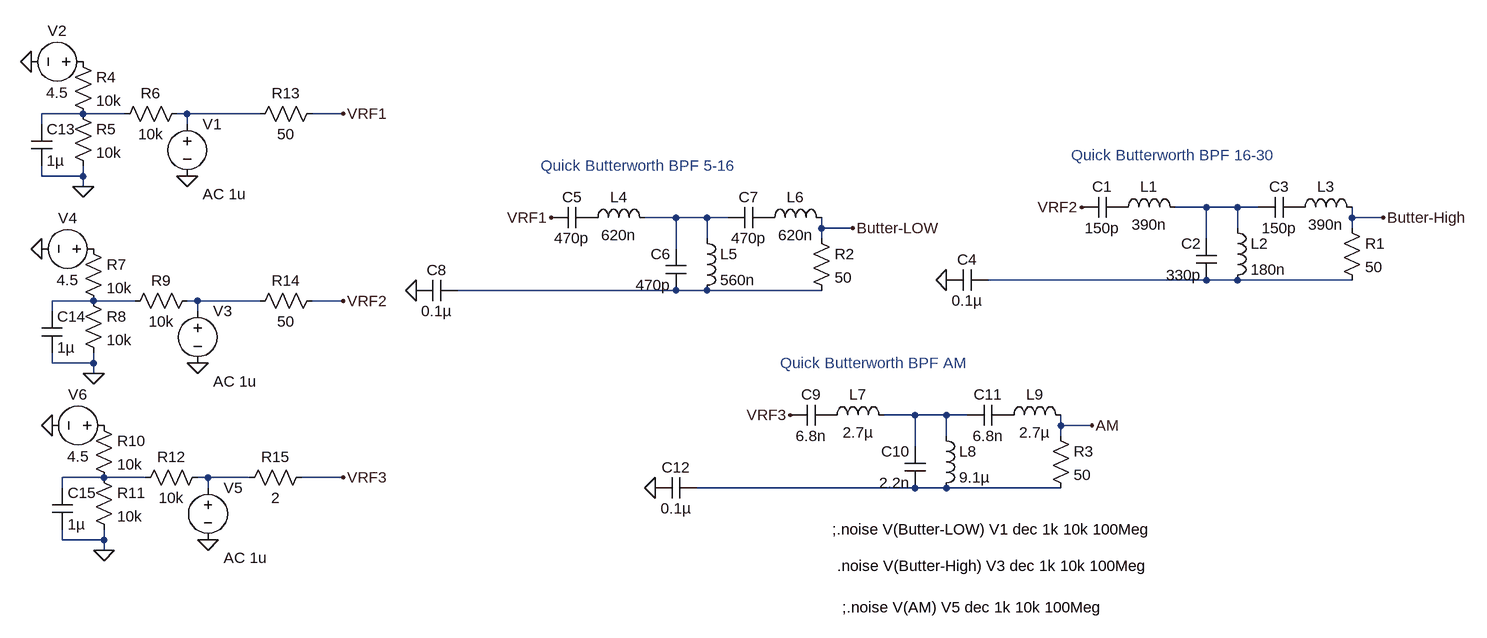
[diagram p0: schematic BPF_noise_analysis.asc]
BPF_noise_analysis.asc, the LTspice schematic file:
Version 4
SHEET 1 1868 808
WIRE -288 32 -352 32
WIRE -224 32 -288 32
WIRE -128 32 -144 32
WIRE -16 32 -128 32
WIRE 112 32 64 32
WIRE -352 48 -352 32
WIRE -128 48 -128 32
WIRE -352 128 -352 112
WIRE -288 128 -288 112
WIRE -288 128 -352 128
WIRE -288 144 -288 128
WIRE 1440 176 1392 176
WIRE 1488 176 1440 176
WIRE 1520 176 1488 176
WIRE 624 192 576 192
WIRE 672 192 624 192
WIRE 704 192 672 192
WIRE 1664 192 1664 176
WIRE 1712 192 1664 192
WIRE 848 208 848 192
WIRE 896 208 848 208
WIRE 1488 208 1488 176
WIRE 1664 208 1664 192
WIRE 672 224 672 192
WIRE 848 224 848 208
WIRE 1440 224 1440 176
WIRE 624 240 624 192
WIRE 1440 288 1104 288
WIRE 1488 288 1440 288
WIRE 1664 288 1488 288
WIRE 624 304 288 304
WIRE 672 304 624 304
WIRE 848 304 672 304
WIRE -272 320 -336 320
WIRE -208 320 -272 320
WIRE -112 320 -128 320
WIRE -16 320 -112 320
WIRE 112 320 64 320
WIRE -336 336 -336 320
WIRE -112 336 -112 320
WIRE -336 416 -336 400
WIRE -272 416 -272 400
WIRE -272 416 -336 416
WIRE -272 432 -272 416
WIRE 992 496 944 496
WIRE 1040 496 992 496
WIRE 1072 496 1040 496
WIRE 1216 512 1216 496
WIRE 1264 512 1216 512
WIRE 1040 528 1040 496
WIRE 1216 528 1216 512
WIRE 992 544 992 496
WIRE -256 592 -320 592
WIRE -192 592 -256 592
WIRE -96 592 -112 592
WIRE -32 592 -96 592
WIRE 112 592 48 592
WIRE -320 608 -320 592
WIRE -96 608 -96 592
WIRE 992 608 656 608
WIRE 1040 608 992 608
WIRE 1216 608 1040 608
WIRE -320 688 -320 672
WIRE -256 688 -256 672
WIRE -256 688 -320 688
WIRE -256 704 -256 688
FLAG 112 32 VRF1
FLAG 1040 288 0
FLAG 1712 192 Butter-High
FLAG 1248 176 VRF2
FLAG 224 304 0
FLAG 896 208 Butter-LOW
FLAG 432 192 VRF1
FLAG 592 608 0
FLAG 1264 512 AM
FLAG 800 496 VRF3
FLAG -128 128 0
FLAG -368 -48 0
FLAG -288 144 0
FLAG 112 320 VRF2
FLAG -112 416 0
FLAG -352 240 0
FLAG -272 432 0
FLAG 112 592 VRF3
FLAG -96 688 0
FLAG -336 512 0
FLAG -256 704 0
SYMBOL res 1648 192 R0
SYMATTR InstName R1
SYMATTR Value 50
SYMBOL cap 1312 160 R90
WINDOW 0 0 32 VBottom 2
WINDOW 3 32 32 VTop 2
SYMATTR InstName C1
SYMATTR Value 150p
SYMBOL cap 1456 288 R180
WINDOW 0 24 56 Left 2
WINDOW 3 24 8 Left 2
SYMATTR InstName C2
SYMATTR Value 330p
SYMBOL cap 1520 192 R270
WINDOW 0 32 32 VTop 2
WINDOW 3 0 32 VBottom 2
SYMATTR InstName C3
SYMATTR Value 150p
SYMBOL ind 1296 192 R270
WINDOW 0 32 56 VTop 2
WINDOW 3 5 56 VBottom 2
SYMATTR InstName L1
SYMATTR Value 390n
SYMBOL ind 1472 192 R0
SYMATTR InstName L2
SYMATTR Value 180n
SYMBOL ind 1568 192 R270
WINDOW 0 32 56 VTop 2
WINDOW 3 5 56 VBottom 2
SYMATTR InstName L3
SYMATTR Value 390n
SYMBOL cap 1104 272 R90
WINDOW 0 0 32 VBottom 2
WINDOW 3 32 32 VTop 2
SYMATTR InstName C4
SYMATTR Value 0.1µ
SYMBOL res 832 208 R0
SYMATTR InstName R2
SYMATTR Value 50
SYMBOL cap 496 176 R90
WINDOW 0 0 32 VBottom 2
WINDOW 3 32 32 VTop 2
SYMATTR InstName C5
SYMATTR Value 470p
SYMBOL cap 640 304 R180
WINDOW 0 24 56 Left 2
WINDOW 3 24 8 Left 2
SYMATTR InstName C6
SYMATTR Value 470p
SYMBOL cap 704 208 R270
WINDOW 0 32 32 VTop 2
WINDOW 3 0 32 VBottom 2
SYMATTR InstName C7
SYMATTR Value 470p
SYMBOL ind 480 208 R270
WINDOW 0 32 56 VTop 2
WINDOW 3 5 56 VBottom 2
SYMATTR InstName L4
SYMATTR Value 620n
SYMBOL ind 656 208 R0
SYMATTR InstName L5
SYMATTR Value 560n
SYMBOL ind 752 208 R270
WINDOW 0 32 56 VTop 2
WINDOW 3 5 56 VBottom 2
SYMATTR InstName L6
SYMATTR Value 620n
SYMBOL cap 288 288 R90
WINDOW 0 0 32 VBottom 2
WINDOW 3 32 32 VTop 2
SYMATTR InstName C8
SYMATTR Value 0.1µ
SYMBOL res 1200 512 R0
SYMATTR InstName R3
SYMATTR Value 50
SYMBOL cap 864 480 R90
WINDOW 0 0 32 VBottom 2
WINDOW 3 32 32 VTop 2
SYMATTR InstName C9
SYMATTR Value 6.8n
SYMBOL cap 1008 608 R180
WINDOW 0 24 56 Left 2
WINDOW 3 24 8 Left 2
SYMATTR InstName C10
SYMATTR Value 2.2n
SYMBOL cap 1072 512 R270
WINDOW 0 32 32 VTop 2
WINDOW 3 0 32 VBottom 2
SYMATTR InstName C11
SYMATTR Value 6.8n
SYMBOL ind 848 512 R270
WINDOW 0 32 56 VTop 2
WINDOW 3 5 56 VBottom 2
SYMATTR InstName L7
SYMATTR Value 2.7µ
SYMBOL ind 1024 512 R0
SYMATTR InstName L8
SYMATTR Value 9.1µ
SYMBOL ind 1120 512 R270
WINDOW 0 32 56 VTop 2
WINDOW 3 5 56 VBottom 2
SYMATTR InstName L9
SYMATTR Value 2.7µ
SYMBOL cap 656 592 R90
WINDOW 0 0 32 VBottom 2
WINDOW 3 32 32 VTop 2
SYMATTR InstName C12
SYMATTR Value 0.1µ
SYMBOL voltage -128 32 R0
WINDOW 123 24 124 Left 2
WINDOW 39 0 0 Left 0
SYMATTR Value2 AC 1u
SYMATTR InstName V1
SYMATTR Value ""
SYMBOL voltage -272 -48 R90
WINDOW 0 -32 56 VBottom 2
WINDOW 3 32 56 VTop 2
WINDOW 123 0 0 Left 0
WINDOW 39 0 0 Left 0
SYMATTR InstName V2
SYMATTR Value 4.5
SYMBOL res -304 -64 R0
SYMATTR InstName R4
SYMATTR Value 10k
SYMBOL res -304 16 R0
SYMATTR InstName R5
SYMATTR Value 10k
SYMBOL cap -368 48 R0
SYMATTR InstName C13
SYMATTR Value 1µ
SYMBOL res -128 16 R90
WINDOW 0 0 56 VBottom 2
WINDOW 3 32 56 VTop 2
SYMATTR InstName R6
SYMATTR Value 10k
SYMBOL voltage -112 320 R0
WINDOW 123 24 124 Left 2
WINDOW 39 0 0 Left 0
SYMATTR Value2 AC 1u
SYMATTR InstName V3
SYMATTR Value ""
SYMBOL voltage -256 240 R90
WINDOW 0 -32 56 VBottom 2
WINDOW 3 32 56 VTop 2
WINDOW 123 0 0 Left 0
WINDOW 39 0 0 Left 0
SYMATTR InstName V4
SYMATTR Value 4.5
SYMBOL res -288 224 R0
SYMATTR InstName R7
SYMATTR Value 10k
SYMBOL res -288 304 R0
SYMATTR InstName R8
SYMATTR Value 10k
SYMBOL cap -352 336 R0
SYMATTR InstName C14
SYMATTR Value 1µ
SYMBOL res -112 304 R90
WINDOW 0 0 56 VBottom 2
WINDOW 3 32 56 VTop 2
SYMATTR InstName R9
SYMATTR Value 10k
SYMBOL voltage -96 592 R0
WINDOW 123 24 124 Left 2
WINDOW 39 0 0 Left 0
SYMATTR Value2 AC 1u
SYMATTR InstName V5
SYMATTR Value ""
SYMBOL voltage -240 512 R90
WINDOW 0 -32 56 VBottom 2
WINDOW 3 32 56 VTop 2
WINDOW 123 0 0 Left 0
WINDOW 39 0 0 Left 0
SYMATTR InstName V6
SYMATTR Value 4.5
SYMBOL res -272 496 R0
SYMATTR InstName R10
SYMATTR Value 10k
SYMBOL res -272 576 R0
SYMATTR InstName R11
SYMATTR Value 10k
SYMBOL cap -336 608 R0
SYMATTR InstName C15
SYMATTR Value 1µ
SYMBOL res -96 576 R90
WINDOW 0 0 56 VBottom 2
WINDOW 3 32 56 VTop 2
SYMATTR InstName R12
SYMATTR Value 10k
SYMBOL res 80 16 R90
WINDOW 0 0 56 VBottom 2
WINDOW 3 32 56 VTop 2
SYMATTR InstName R13
SYMATTR Value 50
SYMBOL res 80 304 R90
WINDOW 0 0 56 VBottom 2
WINDOW 3 32 56 VTop 2
SYMATTR InstName R14
SYMATTR Value 50
SYMBOL res 64 576 R90
WINDOW 0 0 56 VBottom 2
WINDOW 3 32 56 VTop 2
SYMATTR InstName R15
SYMATTR Value 2
TEXT 1232 96 Left 2 ;Quick Butterworth BPF 16-30
TEXT 416 112 Left 2 ;Quick Butterworth BPF 5-16
TEXT 784 416 Left 2 ;Quick Butterworth BPF AM
TEXT 864 672 Left 2 !;.noise V(Butter-LOW) V1 dec 1k 10k 100Meg
TEXT 872 728 Left 2 !.noise V(Butter-High) V3 dec 1k 10k 100Meg
TEXT 880 792 Left 2 !;.noise V(AM) V5 dec 1k 10k 100Meg

The netlist it stands for:
* BPF_noise_analysis.asc
R1 Butter-High N005 50
C1 P001 VRF2 150p
C2 N005 N003 330p
C3 N003 P002 150p
L1 P001 N003 390n
L2 N003 N005 180n
L3 P002 Butter-High 390n
C4 N005 0 0.1µ
R2 Butter-LOW N006 50
C5 P003 VRF1 470p
C6 N006 N004 470p
C7 N004 P004 470p
L4 P003 N004 620n
L5 N004 N006 560n
L6 P004 Butter-LOW 620n
C8 N006 0 0.1µ
R3 AM N012 50
C9 P005 VRF3 6.8n
C10 N012 N009 2.2n
C11 N009 P006 6.8n
L7 P005 N009 2.7µ
L8 N009 N012 9.1µ
L9 P006 AM 2.7µ
C12 N012 0 0.1µ
V1 N002 0 AC 1u
V2 P007 0 4.5
R4 P007 N001 10k
R5 N001 0 10k
C13 N001 0 1µ
R6 N002 N001 10k
V3 N008 0 AC 1u
V4 P008 0 4.5
R7 P008 N007 10k
R8 N007 0 10k
C14 N007 0 1µ
R9 N008 N007 10k
V5 N011 0 AC 1u
V6 P009 0 4.5
R10 P009 N010 10k
R11 N010 0 10k
C15 N010 0 1µ
R12 N011 N010 10k
R13 VRF1 N002 50
R14 VRF2 N008 50
R15 VRF3 N011 2
* Quick Butterworth BPF 16-30
* Quick Butterworth BPF 5-16
* Quick Butterworth BPF AM
;.noise V(Butter-LOW) V1 dec 1k 10k 100Meg
.noise V(Butter-High) V3 dec 1k 10k 100Meg
;.noise V(AM) V5 dec 1k 10k 100Meg
.backanno
.end